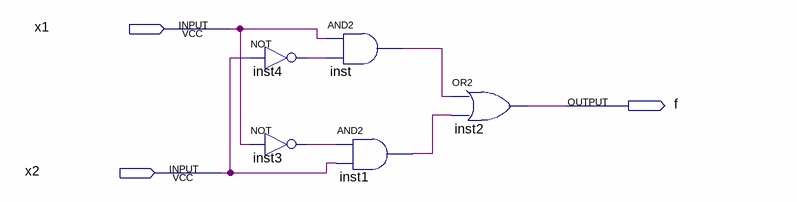
[diagram p0: schematic sheet]
// Quartus schematic lightBDF.bdf as structural Verilog: 5 symbols, 3 pins
module lightBDF (
  input  x1,
  input  x2,
  output f
);

  wire inst1_out, inst3_out, inst4_out, inst_out;

  not inst4 (inst4_out, x2);
  not inst3 (inst3_out, x1);
  and inst (inst_out, x1, inst4_out);
  and inst1 (inst1_out, inst3_out, x2);
  or inst2 (f, inst_out, inst1_out);
endmodule
